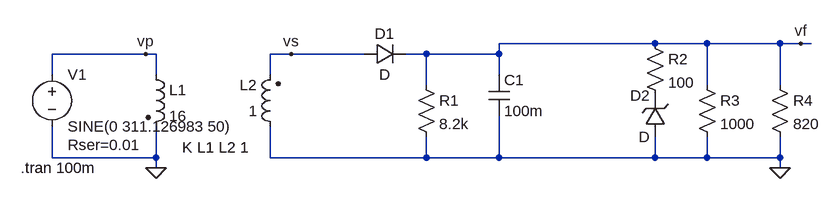
[diagram p0: schematic half wave.asc]
half wave.asc, the LTspice schematic file:
Version 4
SHEET 1 1028 680
WIRE 752 112 512 112
WIRE 832 112 752 112
WIRE 944 112 832 112
WIRE 976 112 944 112
WIRE 992 112 976 112
WIRE -32 128 -176 128
WIRE -16 128 -32 128
WIRE 192 128 160 128
WIRE 304 128 192 128
WIRE 400 128 368 128
WIRE 512 128 512 112
WIRE 512 128 400 128
WIRE -176 160 -176 128
WIRE -16 160 -16 128
WIRE 160 160 160 128
WIRE 512 160 512 128
WIRE 400 176 400 128
WIRE 832 176 832 112
WIRE 944 176 944 112
WIRE -176 288 -176 240
WIRE -16 288 -16 240
WIRE -16 288 -176 288
WIRE 160 288 160 240
WIRE 400 288 400 256
WIRE 400 288 160 288
WIRE 512 288 512 224
WIRE 512 288 400 288
WIRE 752 288 752 256
WIRE 752 288 512 288
WIRE 832 288 832 256
WIRE 832 288 752 288
WIRE 944 288 944 256
WIRE 944 288 832 288
WIRE -16 304 -16 288
WIRE 944 304 944 288
FLAG -16 304 0
FLAG -32 128 vp
FLAG 192 128 vs
FLAG 944 304 0
FLAG 976 112 vf
SYMBOL voltage -176 144 R0
WINDOW 123 0 0 Left 0
WINDOW 39 24 124 Left 2
SYMATTR SpiceLine Rser=0.01
SYMATTR InstName V1
SYMATTR Value SINE(0 311.126983 50)
SYMBOL ind2 -32 144 R0
SYMATTR InstName L1
SYMATTR Value 16
SYMATTR Type ind
SYMBOL ind2 176 256 R180
WINDOW 0 36 80 Left 2
WINDOW 3 36 40 Left 2
SYMATTR InstName L2
SYMATTR Value 1
SYMATTR Type ind
SYMBOL diode 304 144 R270
WINDOW 0 32 32 VTop 2
WINDOW 3 0 32 VBottom 2
SYMATTR InstName D1
SYMBOL res 384 160 R0
SYMATTR InstName R1
SYMATTR Value 8.2k
SYMBOL cap 496 160 R0
SYMATTR InstName C1
SYMATTR Value 100m
SYMBOL zener 768 256 R180
WINDOW 0 24 64 Left 2
WINDOW 3 24 0 Left 2
SYMATTR InstName D2
SYMBOL res 736 96 R0
SYMATTR InstName R2
SYMATTR Value 100
SYMBOL res 816 160 R0
SYMATTR InstName R3
SYMATTR Value 1000
SYMBOL res 928 160 R0
SYMATTR InstName R4
SYMATTR Value 820
TEXT -224 304 Left 2 !.tran 100m
TEXT 24 272 Left 2 !K L1 L2 1

The netlist it stands for:
* half wave.asc
V1 vp 0 SINE(0 311.126983 50) Rser=0.01
L1 vp 0 16
L2 0 vs 1
D1 vs vf D
R1 vf 0 8.2k
C1 vf 0 100m
D2 0 P001 D
R2 vf P001 100
R3 vf 0 1000
R4 vf 0 820
.model D D
.lib standard.dio
.tran 100m
K L1 L2 1
.backanno
.end